# EAGLE schematic sensori di linea soccer 2018 (EAGLE 8.3.2)
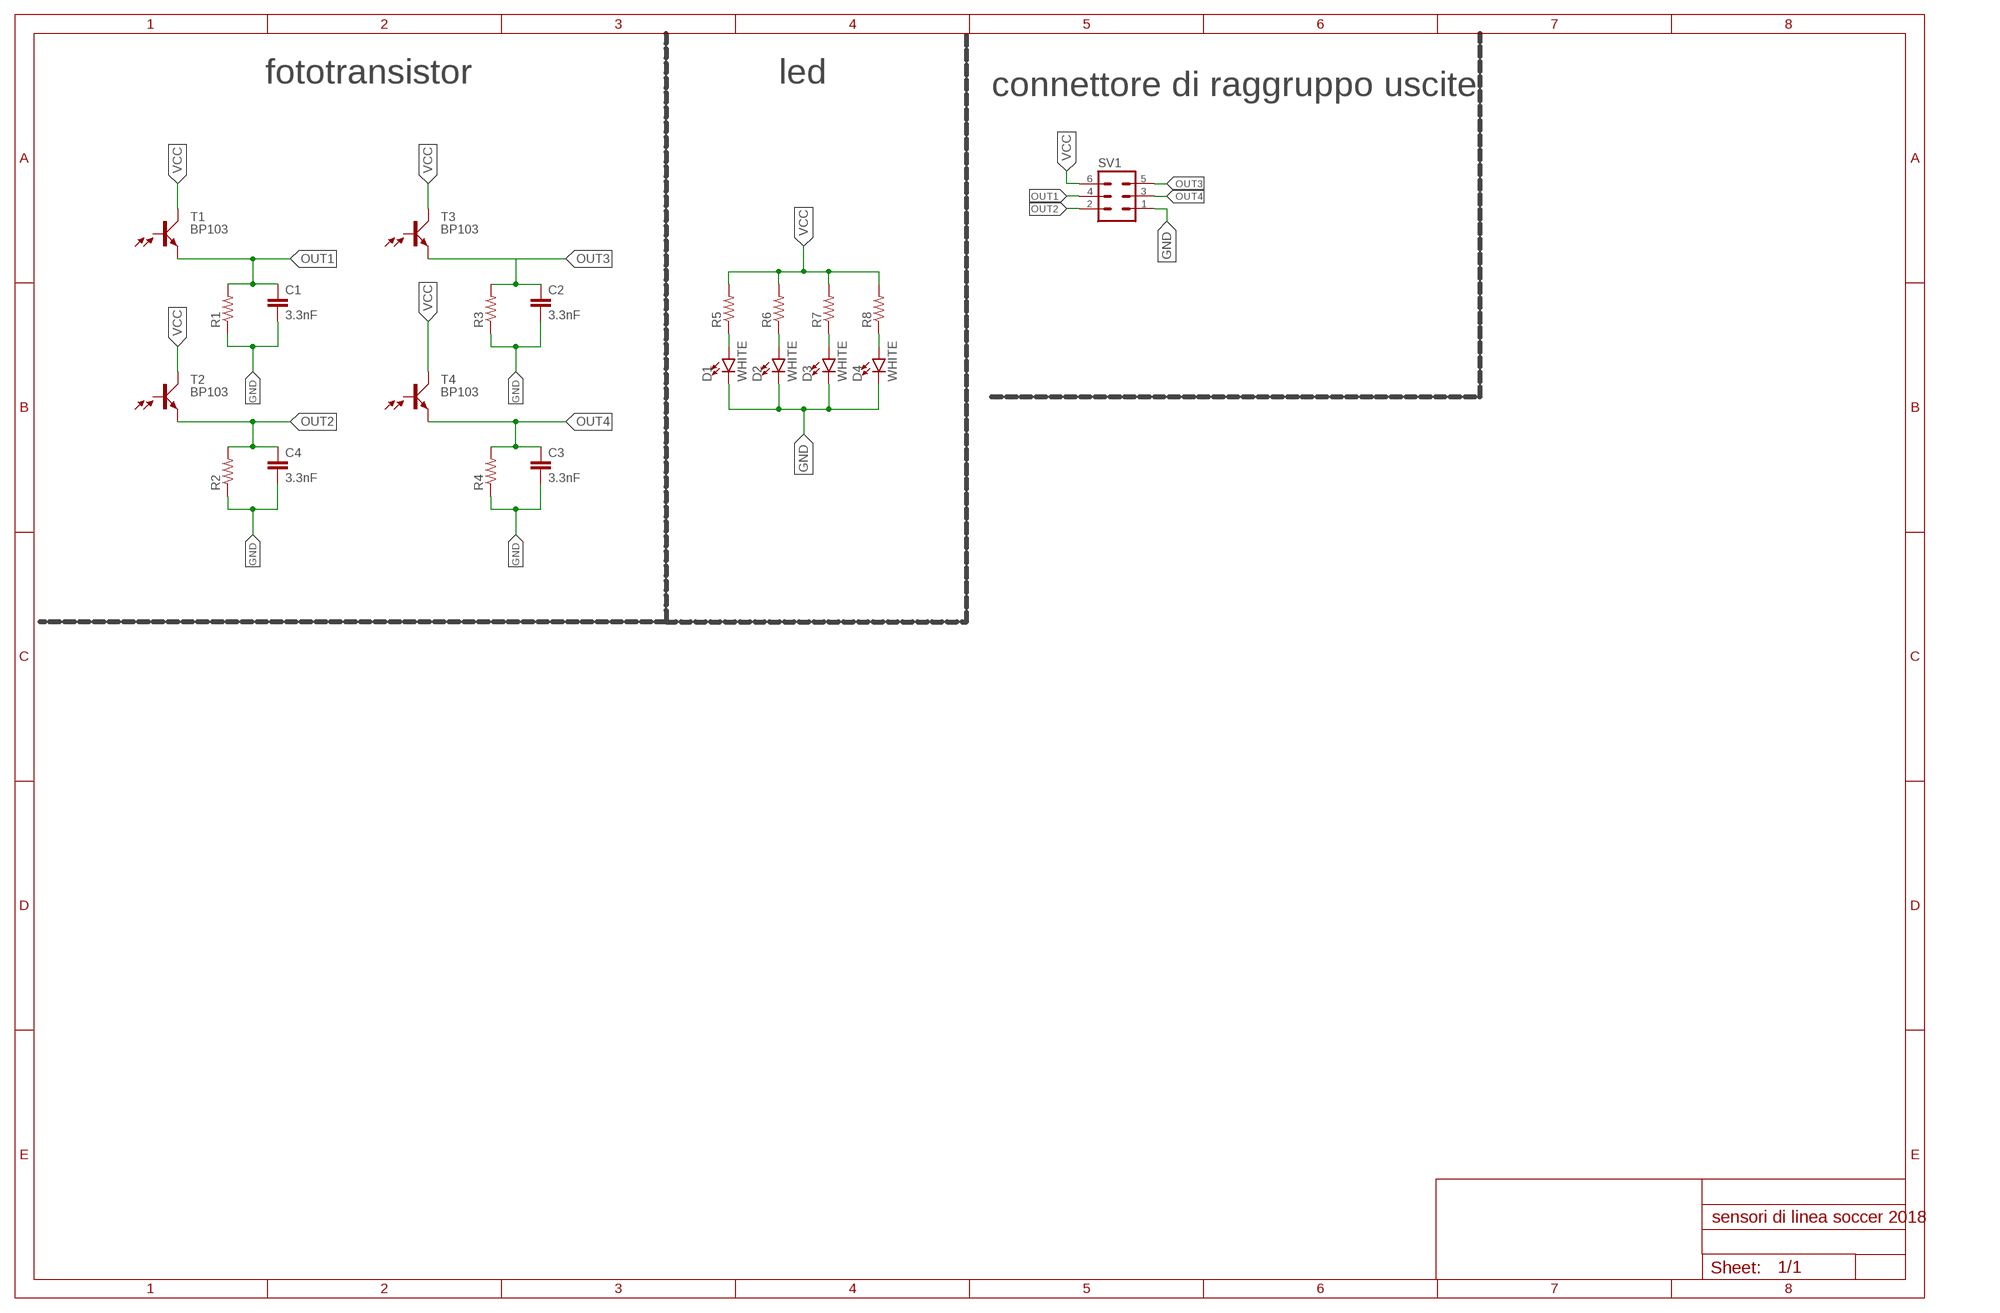
[diagram p0: schematic, sheet 1]

## Parts
C1  3.3nF  3.3NF-0603-100V-10%  [0603]
C2  3.3nF  3.3NF-0603-100V-10%  [0603]
C3  3.3nF  3.3NF-0603-100V-10%  [0603]
C4  3.3nF  3.3NF-0603-100V-10%  [0603]
D1  WHITE  LED-WHITE1206  [LED-1206]
D2  WHITE  LED-WHITE1206  [LED-1206]
D3  WHITE  LED-WHITE1206  [LED-1206]
D4  WHITE  LED-WHITE1206  [LED-1206]
R1  R-US_0204/7  [0204/7]
R2  R-US_0204/7  [0204/7]
R3  R-US_0204/7  [0204/7]
R4  R-US_0204/7  [0204/7]
R5  R-US_0204/7  [0204/7]
R6  R-US_0204/7  [0204/7]
R7  R-US_0204/7  [0204/7]
R8  R-US_0204/7  [0204/7]
SV1  MA03-2  [MA03-2]
T1  BP103  [BP103]
T2  BP103  [BP103]
T3  BP103  [BP103]
T4  BP103  [BP103]

## Nets
GND: C1.2 C2.2 C3.2 C4.2 D1.C D2.C D3.C D4.C R1.1 R2.1 R3.1 R4.1 SV1.1
N$2: D1.A R5.1
N$3: D2.A R6.1
N$4: D3.A R7.1
N$5: D4.A R8.1
OUT1: C1.1 R1.2 SV1.4 T1.E
OUT2: C4.1 R2.2 SV1.2 T2.E
OUT3: C2.1 R3.2 SV1.5 T3.E
OUT4: C3.1 R4.2 SV1.3 T4.E
VCC: R5.2 R6.2 R7.2 R8.2 SV1.6 T1.C T2.C T3.C T4.C
Unconnected: T1.B T2.B T3.B T4.B

## Notes on the sheet
- fototransistor | led
- connettore di raggruppo uscite

## Library data of the parts
C1-C4 = SparkFun-Capacitors:3.3NF: 3.3nF ceramic capacitors A capacitor is a passive two-terminal electrical component used to store electrical energy temporarily in an electric field.; PROD_ID: CAP-09633
D1-D4 = SparkFun-LED:LED-WHITE: White SMD LED Used in manufacturing several products at SparkFun. Packages: 0603 - Bright White SMD 0603 package[Product Link] <http://www.kingbrightusa.com/product.asp?catalog_name=LED&product_id=APT1608QWF/D> 1206 - Bright White SMD1206 package [Product Link] <http://www.kingbrightusa.com/product.asp?catalog_name=LED&product_id=APT3216QWF/D> 3014 - Super Bright SMD 3014 package [Datasheet] <http://www.lumileds.com/uploads/459/DS208-pdf> SparkFun Products: Blackberry Trackballer Breakout <https://www.sparkfun.com/products/13169> Digital SandBox <https://www.sparkfun.com/products/12651>; PROD_ID: DIO-09955
R1-R4 = resistor:R-US_: RESISTOR, American symbol
R5-R8 = rcl:R-US_: RESISTOR, American symbol
SV1 = con-lstb:MA03-2: PIN HEADER; OC_FARNELL: unknown; OC_NEWARK: unknown
T1-T4 = opto-trans-siemens:BP103: PHOTO TRANSISTOR; OC_FARNELL: unknown; OC_NEWARK: unknown